# EAGLE schematic P16-Fotorresistencia (LDR) (EAGLE 9.6.2)
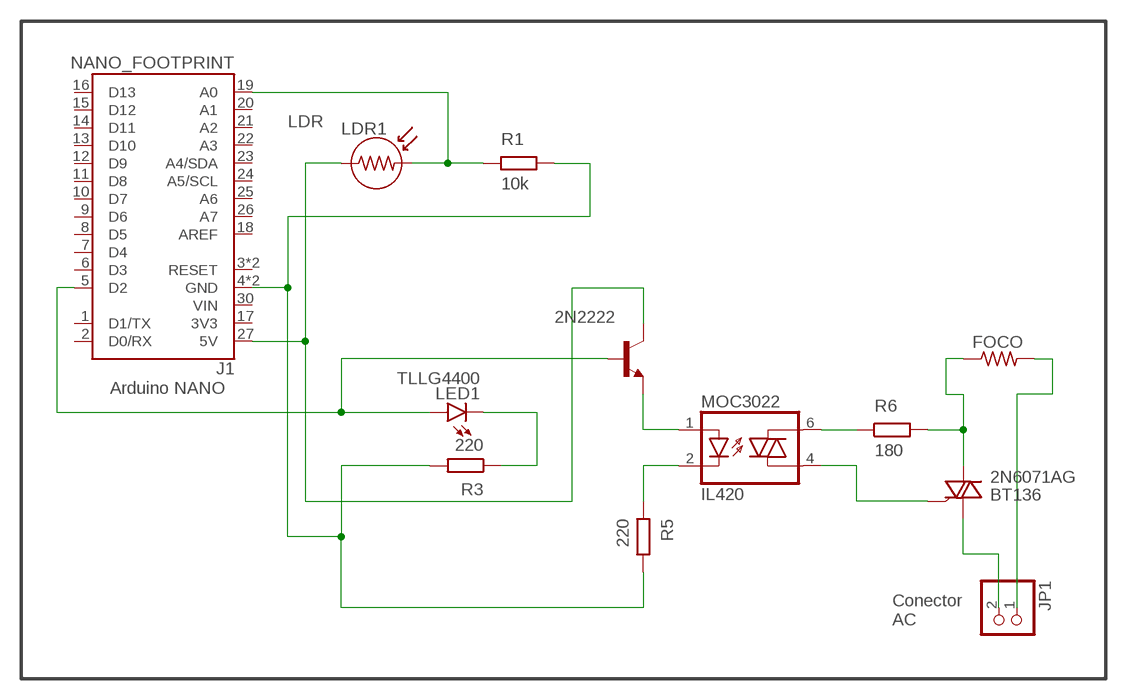
[diagram p0: schematic, sheet 1]

## Parts
2N6071AG  BT136  [TO220AB]
FOCO  R-US_0204/2V  [0204V]
J1  NANO_FOOTPRINT  [NANO]
JP1  PINHD-1X2/90  [1X02/90]
LDR1  LDR  [LDR]
LED1  TLLG4400  [LED3MM]
MOC3022  IL420  [DIL06]
R1  10k  R  (no package)
R3  220  R  (no package)
R5  220  R  (no package)
R6  180  R  (no package)
T2  2N2222  [TO18]

## Nets
N$1: J1.19(A0) LDR1.2 R1.1
N$3: J1.27(5V) LDR1.1 T2.3(C)
N$5: LED1.K(C) R3.1
N$6: J1.4(GND) J1.29(GND) R1.2 R3.2 R5.2
N$7: MOC3022.1(A) T2.1(E)
N$8: 2N6071AG.3(G) MOC3022.4(A1)
N$9: MOC3022.2(C) R5.1
N$10: MOC3022.6(A2) R6.1
N$11: 2N6071AG.2(A2) FOCO.1 R6.2
N$12: 2N6071AG.1(A1) JP1.2
N$14: FOCO.2 JP1.1
N$15: J1.5(D2) LED1.A T2.2(B)
Unconnected: J1.1(D1/TX) J1.2(D0/RX) J1.3(RESET) J1.6(D3) J1.7(D4) J1.8(D5) J1.9(D6) J1.10(D7) J1.11(D8) J1.12(D9) J1.13(D10) J1.14(D11) J1.15(D12) J1.16(D13) J1.17(3V3) J1.18(AREF) J1.20(A1) J1.21(A2) J1.22(A3) J1.23(A4/SDA) J1.24(A5/SCL) J1.25(A6) J1.26(A7) J1.28(RESET) J1.30(VIN)

## Notes on the sheet
- LDR
- Arduino NANO
- Conector
  AC

## Library data of the parts
2N6071AG = triac:BT136: Triac BT136 series E sensitive gate Source: http://www.nxp.com/acrobat_download/datasheets/BT136_SERIES_E_2.pdf
FOCO = rcl:R-US_: RESISTOR, American symbol; SPICEPREFIX: R
J1 = SparkFun-Boards:NANO_FOOTPRINT: Generic Nano Footprint
JP1 = pinhead:PINHD-1X2: PIN HEADER
LDR1 = MCE_Sensores:LDR: Fotoresistencia
LED1 = led:TLLG4400: Low Current (2mA) LED 3 mm Tinted Diffused Package color GREEN Source: Data sheet <http://www.farnell.com/datasheets/391098.pdf>; MF: VISHAY SEMICONDUCTOR; OC_FARNELL: 1612435
MOC3022 = optocoupler:IL420: SIEMENS OPTO COUPLER; MF: VISHAY/TELEFUNKEN; MPN: IL420; OC_FARNELL: 1469561; OC_NEWARK: 58K1719
R1 R3 R5 R6 = ngspice-simulation:R: RESISTOR
T2 = transistor:2N2222: NPN TRANSISTOR